# EAGLE design dac (EAGLE 9.6.2)
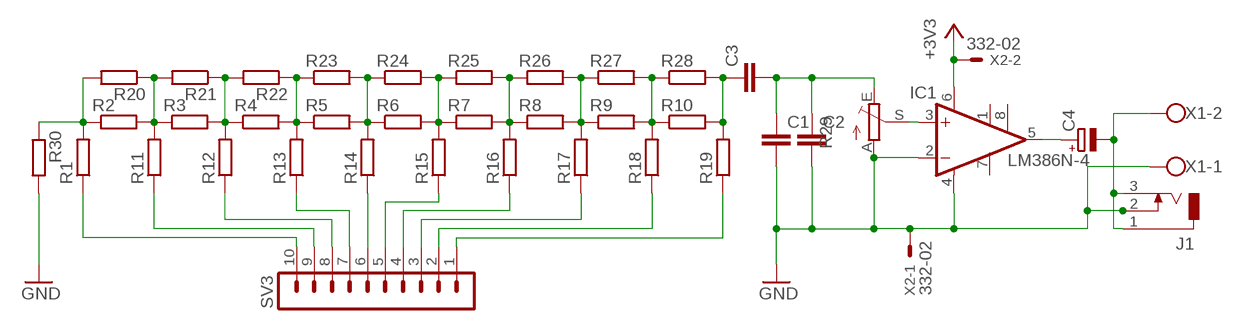
[diagram p0: schematic, sheet 1]

## Parts
C1  C5/4.5  [C5B4.5]
C2  C5/4.5  [C5B4.5]
C3  C5/4.5  [C5B4.5]
C4  CPOL-EUE5-6  [E5-6]
IC1  LM386N-4  [DIL08]
J1  DCJ0303  [DCJ0303]
R1  R-EU_0309/10  [0309/10]
R2  R-EU_0309/10  [0309/10]
R3  R-EU_0309/10  [0309/10]
R4  R-EU_0309/10  [0309/10]
R5  R-EU_0309/10  [0309/10]
R6  R-EU_0309/10  [0309/10]
R7  R-EU_0309/10  [0309/10]
R8  R-EU_0309/10  [0309/10]
R9  R-EU_0309/10  [0309/10]
R10  R-EU_0309/10  [0309/10]
R11  R-EU_0309/10  [0309/10]
R12  R-EU_0309/10  [0309/10]
R13  R-EU_0309/10  [0309/10]
R14  R-EU_0309/10  [0309/10]
R15  R-EU_0309/10  [0309/10]
R16  R-EU_0309/10  [0309/10]
R17  R-EU_0309/10  [0309/10]
R18  R-EU_0309/10  [0309/10]
R19  R-EU_0309/10  [0309/10]
R20  R-EU_0309/10  [0309/10]
R21  R-EU_0309/10  [0309/10]
R22  R-EU_0309/10  [0309/10]
R23  R-EU_0309/10  [0309/10]
R24  R-EU_0309/10  [0309/10]
R25  R-EU_0309/10  [0309/10]
R26  R-EU_0309/10  [0309/10]
R27  R-EU_0309/10  [0309/10]
R28  R-EU_0309/10  [0309/10]
R29  TRIM_EU-CA9V  [CA9V]
R30  R-EU_0309/10  [0309/10]
SV3  MA10-1W  [MA10-1W]
X1  W237-102  [W237-102]
X2  332-02  [332-02]

## Nets
+3V3: IC1.6(VS) X2.2
GND: C1.2 C2.2 IC1.2(-IN) IC1.4(GND) J1.2 R29.A R30.2 X1.1 X2.1
N$1: IC1.3(+IN) R29.S
N$2: R2.2 R3.1 R11.2 R20.1 R21.2
N$3: R3.2 R4.1 R12.2 R21.1 R22.2
N$4: R4.2 R5.1 R13.2 R22.1 R23.1
N$5: R5.2 R6.1 R14.2 R23.2 R24.1
N$6: R6.2 R7.1 R15.2 R24.2 R25.1
N$7: R7.2 R8.1 R16.2 R25.2 R26.1
N$8: R8.2 R9.1 R17.2 R26.2 R27.1
N$9: R9.2 R10.1 R18.2 R27.2 R28.1
N$10: C1.1 C2.1 C3.2 R29.E
N$11: R19.1 SV3.1
N$12: R18.1 SV3.2
N$13: R17.1 SV3.3
N$14: R16.1 SV3.4
N$15: R15.1 SV3.5
N$16: R14.1 SV3.6
N$17: R13.1 SV3.7
N$18: R12.1 SV3.8
N$19: R11.1 SV3.9
N$20: R1.1 SV3.10
N$21: C3.1 R10.2 R19.2 R28.2
N$22: C4.- J1.1 J1.3 X1.2
N$23: C4.+ IC1.5(OUT)
N$24: R1.2 R2.1 R20.2 R30.1
Unconnected: IC1.1(GAIN) IC1.7(BYPASS) IC1.8(GAIN)

## Library data of the parts
C1-C3 = capacitor-wima:C: CAPACITOR naming: grid - package width
C4 = resistor:CPOL-EU: POLARIZED CAPACITOR, European symbol
IC1 = linear:LM386?-*: Low Voltage Audio Power Amplifier Source: http://cache.national.com/ds/LM/LM386.pdf
J1 = con-jack:DCJ0303: DC POWER JACK Source: DCJ0303.pdf; OC_FARNELL: unknown; OC_NEWARK: unknown
R1-R28 R30 = rcl:R-EU_: RESISTOR, European symbol
R29 = pot:TRIM_EU-: POTENTIOMETER
SV3 = con-lstb:MA10-1W: PIN HEADER; OC_FARNELL: unknown; OC_NEWARK: unknown
X1 = con-wago-500:W237-102: WAGO SCREW CLAMP; MPN: 237-102; OC_FARNELL: unknown; OC_NEWARK: 70K9898
X2 = con-garry:332-02: 2 Pin - 2mm Dual Row Source: www.mpe-connector.de / garry_shortform_2012.pdf

## Board
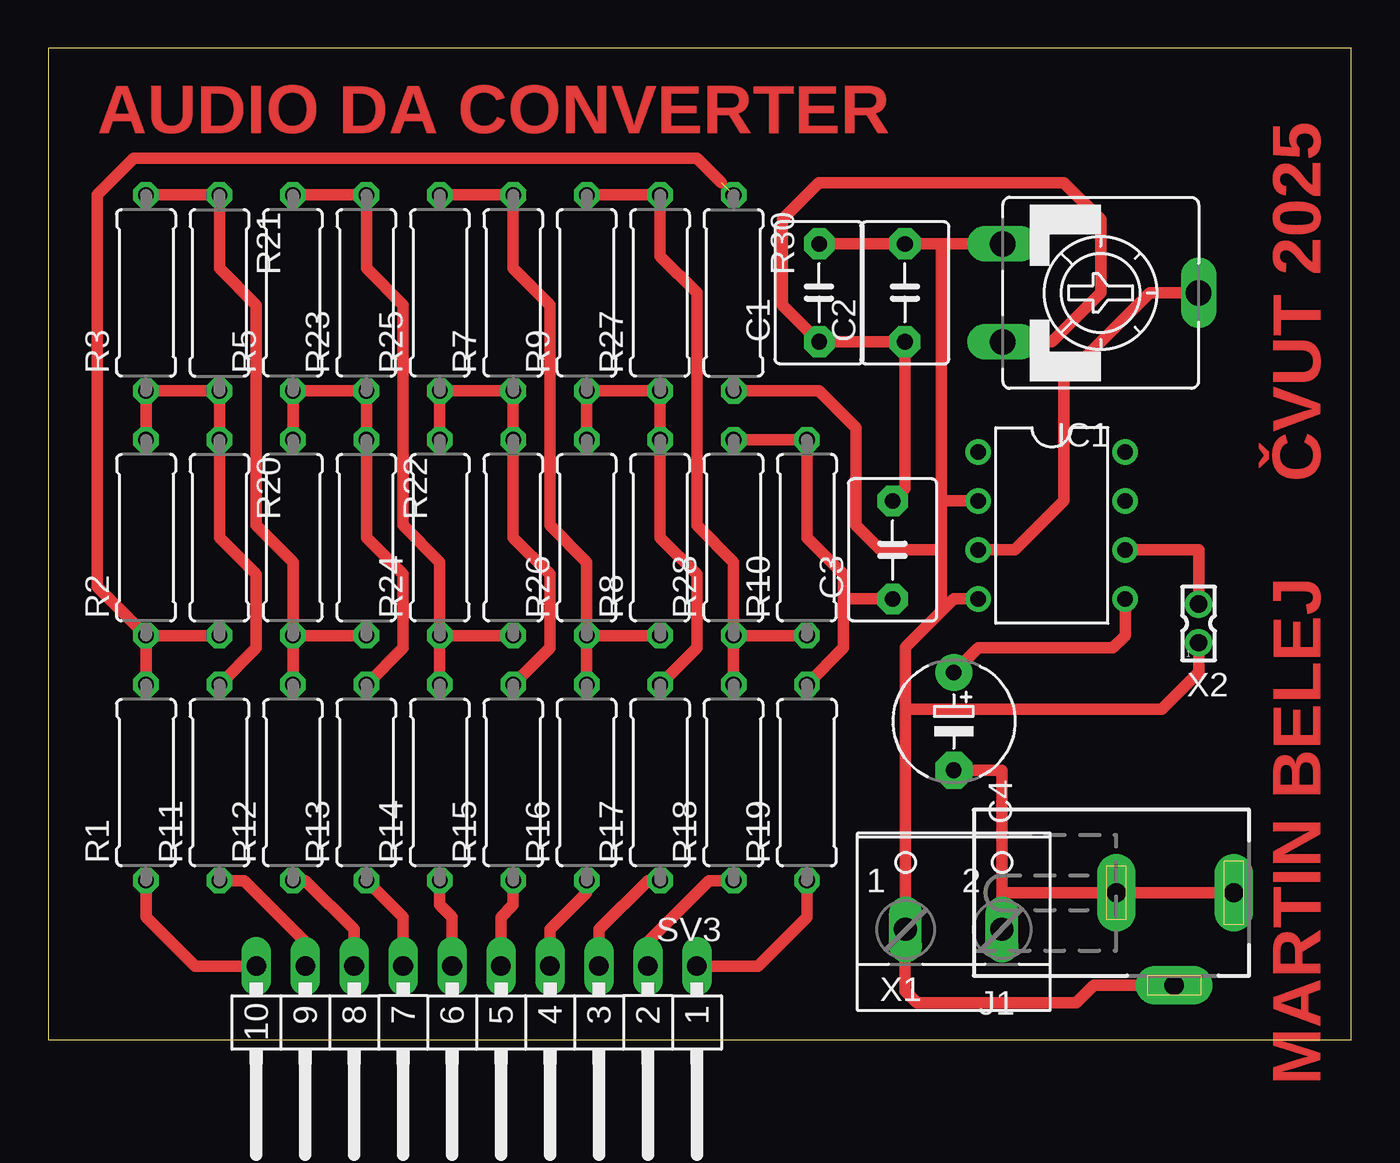
[diagram p1: board, top side]

Size 67.61 x 51.43 mm. Coordinates in mm from the lower left corner, seen from the top.
Outline: 0,0 67.61,0 67.61,51.43 0,51.43 0,0
Copper layers (1*16): Top 0.035mm / dielectric 1.5mm / Bottom 0.035mm
Design rules "default *": minimum track width 6mil, minimum drill 0.1mm, track to track 6mil, track to pad 6mil, pad to pad 6mil, via to via 6mil, smd to smd 6mil, copper to edge 40mil, drill to drill 6mil, minimum pad ring 10mil, minimum via ring 8mil, stop-mask expansion 4mil, vias tented up to drill 0mil, thermal gap 10mil

### Footprints (pad centres in the part's own frame; a part is rotated, then mirrored left to right if it is on the bottom)
C5B4.5 = drill 0.813 pad 1.6 octagon: 1 -2.54,0; 2 2.54,0
E5-6 = drill 0.813 pad 1.905: + -2.54,0 | drill 0.813 pad 1.905 octagon: - 2.54,0
DIL08 = drill 0.813 pad 1.27: 1 -3.81,-3.81; 2 -1.27,-3.81; 3 1.27,-3.81; 4 3.81,-3.81; 5 3.81,3.81; 6 1.27,3.81; 7 -1.27,3.81; 8 -3.81,3.81
DCJ0303 = drill 1 pad 2 long: 1 0,3.1; 2 4.8,0; 3 0,-3
0309/10 = drill 0.813 octagon: 1 -5.08,0; 2 5.08,0
CA9V = drill 1.321 long: A -2.54,-5.08; E 2.54,-5.08; S 0,5.08
MA10-1W = drill 1.016 long: 1 -11.43,0; 2 -8.89,0; 3 -6.35,0; 4 -3.81,0; 5 -1.27,0; 6 1.27,0; 7 3.81,0; 8 6.35,0; 9 8.89,0; 10 11.43,0
W237-102 = drill 1.194 long: 1 -2.5,-1.27; 2 2.5,-1.27
332-02 = drill 0.9 pad 1.27: 1 0,-1; 2 0,1

### Placement (x,y rotation side)
C1  40.01,38.73 90 top
C2  44.45,38.73 90 top
C3  43.81,25.4 90 top
C4  46.99,16.51 270 top
IC1  52.07,26.67 270 top
J1  58.42,7.62 270 top
R1  5.08,13.34 90 top
R2  5.08,26.04 90 top
R3  5.08,38.73 90 top
R4  12.7,26.04 90 top
R5  12.7,38.73 90 top
R6  24.13,26.04 90 top
R7  24.13,38.73 90 top
R8  31.75,26.04 90 top
R9  27.94,38.73 90 top
R10  39.37,26.04 90 top
R11  8.89,13.34 90 top
R12  12.7,13.34 90 top
R13  16.51,13.34 90 top
R14  20.32,13.34 90 top
R15  24.13,13.34 90 top
R16  27.94,13.34 90 top
R17  31.75,13.34 90 top
R18  35.56,13.34 90 top
R19  39.37,13.34 90 top
R20  8.89,26.04 270 top
R21  8.89,38.73 270 top
R22  16.51,26.04 270 top
R23  16.51,38.73 90 top
R24  20.32,26.04 90 top
R25  20.32,38.73 90 top
R26  27.94,26.04 90 top
R27  31.75,38.73 90 top
R28  35.56,26.04 90 top
R29  54.61,38.73 270 top
R30  35.56,38.73 270 top
SV3  22.23,3.81 180 top
X1  46.99,6.99 0 top
X2  59.69,21.59 0 top

### Tracks (layer width: path | path; a pad name or v marks a point on that pad's centre or on a via)
+3V3
  Top 0.6: IC1.6 59.69,25.4 X2.2
GND
  Top 0.6: C1.2 C2.2 46.35,41.27 | X1.1 44.49,17.14 | 44.49,17.14 44.49,20.36 46.35,22.22 | IC1.4 46.99,22.86 46.35,22.22 | 46.35,22.22 46.35,25.4 | 46.35,25.4 46.35,27.94 | IC1.2 46.35,27.94 | 46.35,27.94 46.35,41.27 | X1.1 44.49,4.49 44.45,4.45 | R29.A 46.35,41.27 | 58.38,2.86 J1.2 54.26,2.82 53.34,1.91 45.09,1.91 44.45,2.54 44.45,5.67 X1.1 | 44.49,17.14 57.78,17.14 59.69,19.05 X2.1 | 46.35,25.4 43.18,25.4 41.91,26.67 41.91,31.75 40.01,33.66 R30.2
N$1
  Top 0.6: IC1.3 50.16,25.4 52.7,27.94 52.7,34.29 57.15,38.73 R29.S
N$2
  Top 0.6: R2.2 R3.1 R21.2 R20.1 8.89,26.04 10.79,24.13 10.79,20.32 R11.2
N$3
  Top 0.6: R3.2 R21.1 8.89,40.01 10.79,38.1 10.79,26.67 12.7,24.76 R4.1 | R4.1 R12.2 | R4.1 R22.2
N$4
  Top 0.6: R4.2 R5.1 R23.1 R22.1 16.51,26.04 18.41,24.13 18.41,20.32 R13.2
N$5
  Top 0.6: R5.2 R23.2 16.51,40.01 18.41,38.1 18.41,26.67 20.32,24.76 R24.1 | R24.1 R14.2 | R24.1 R6.1
N$6
  Top 0.6: R24.2 R25.1 R7.1 R6.2 24.13,26.04 26.04,24.13 26.04,20.32 R15.2
N$7
  Top 0.6: R25.2 R7.2 24.13,40.01 26.04,38.1 26.04,26.67 27.94,24.76 R26.1 | R16.2 R26.1 | R26.1 R8.1
N$8
  Top 0.6: R26.2 R9.1 R27.1 R8.2 31.75,26.04 33.66,24.13 33.66,20.32 R17.2
N$9
  Top 0.6: R9.2 R27.2 31.75,40.64 33.66,38.73 33.66,26.67 35.56,24.76 R28.1 | R18.2 R28.1 | R28.1 R10.1
N$10
  Top 0.6: C3.2 44.45,28.57 C2.1 C1.1 38.1,38.1 38.1,42.55 40.01,44.45 52.7,44.45 54.61,42.55 54.61,38.73 52.07,36.2 R29.E
N$11
  Top 0.6: R19.1 39.37,6.35 36.83,3.81 SV3.1
N$12
  Top 0.6: R18.1 34.29,8.26 31.11,5.08 SV3.2
N$13
  Top 0.6: R17.1 31.11,8.26 28.57,5.71 SV3.3
N$14
  Top 0.6: SV3.4 26.04,5.71 27.94,7.62 R16.1
N$15
  Top 0.6: SV3.5 23.5,6.35 24.13,6.99 R15.1
N$16
  Top 0.6: SV3.6 20.95,6.35 20.32,6.99 R14.1
N$17
  Top 0.6: SV3.7 18.41,6.35 R13.1
N$18
  Top 0.6: R12.1 13.34,8.26 15.88,5.71 SV3.8
N$19
  Top 0.6: R11.1 10.16,8.26 13.34,5.08 SV3.9
N$20
  Top 0.6: R1.1 5.08,6.35 7.62,3.81 SV3.10
N$21
  Top 0.6: R28.2 R10.2 39.37,26.04 41.27,24.13 41.27,22.86 | R19.2 41.27,20.32 41.27,22.86 | C3.1 41.27,22.86
N$22
  Top 0.6: C4.- 49.49,13.97 49.49,7.62 | J1.1 J1.3 49.49,7.62 | X1.2 49.49,7.62
N$23
  Top 0.6: IC1.5 55.88,20.95 55.24,20.32 48.26,20.32 C4.+
N$24  (1 unrouted)
  Top 0.6: R1.2 R2.1 | R20.2 R2.1 | R2.1 2.54,23.49 2.54,43.82 4.45,45.72 33.66,45.72 34.92,44.45

### Text on the board
Top: AUDIO DA CONVERTER | MARTIN BELEJ ČVUT 2025